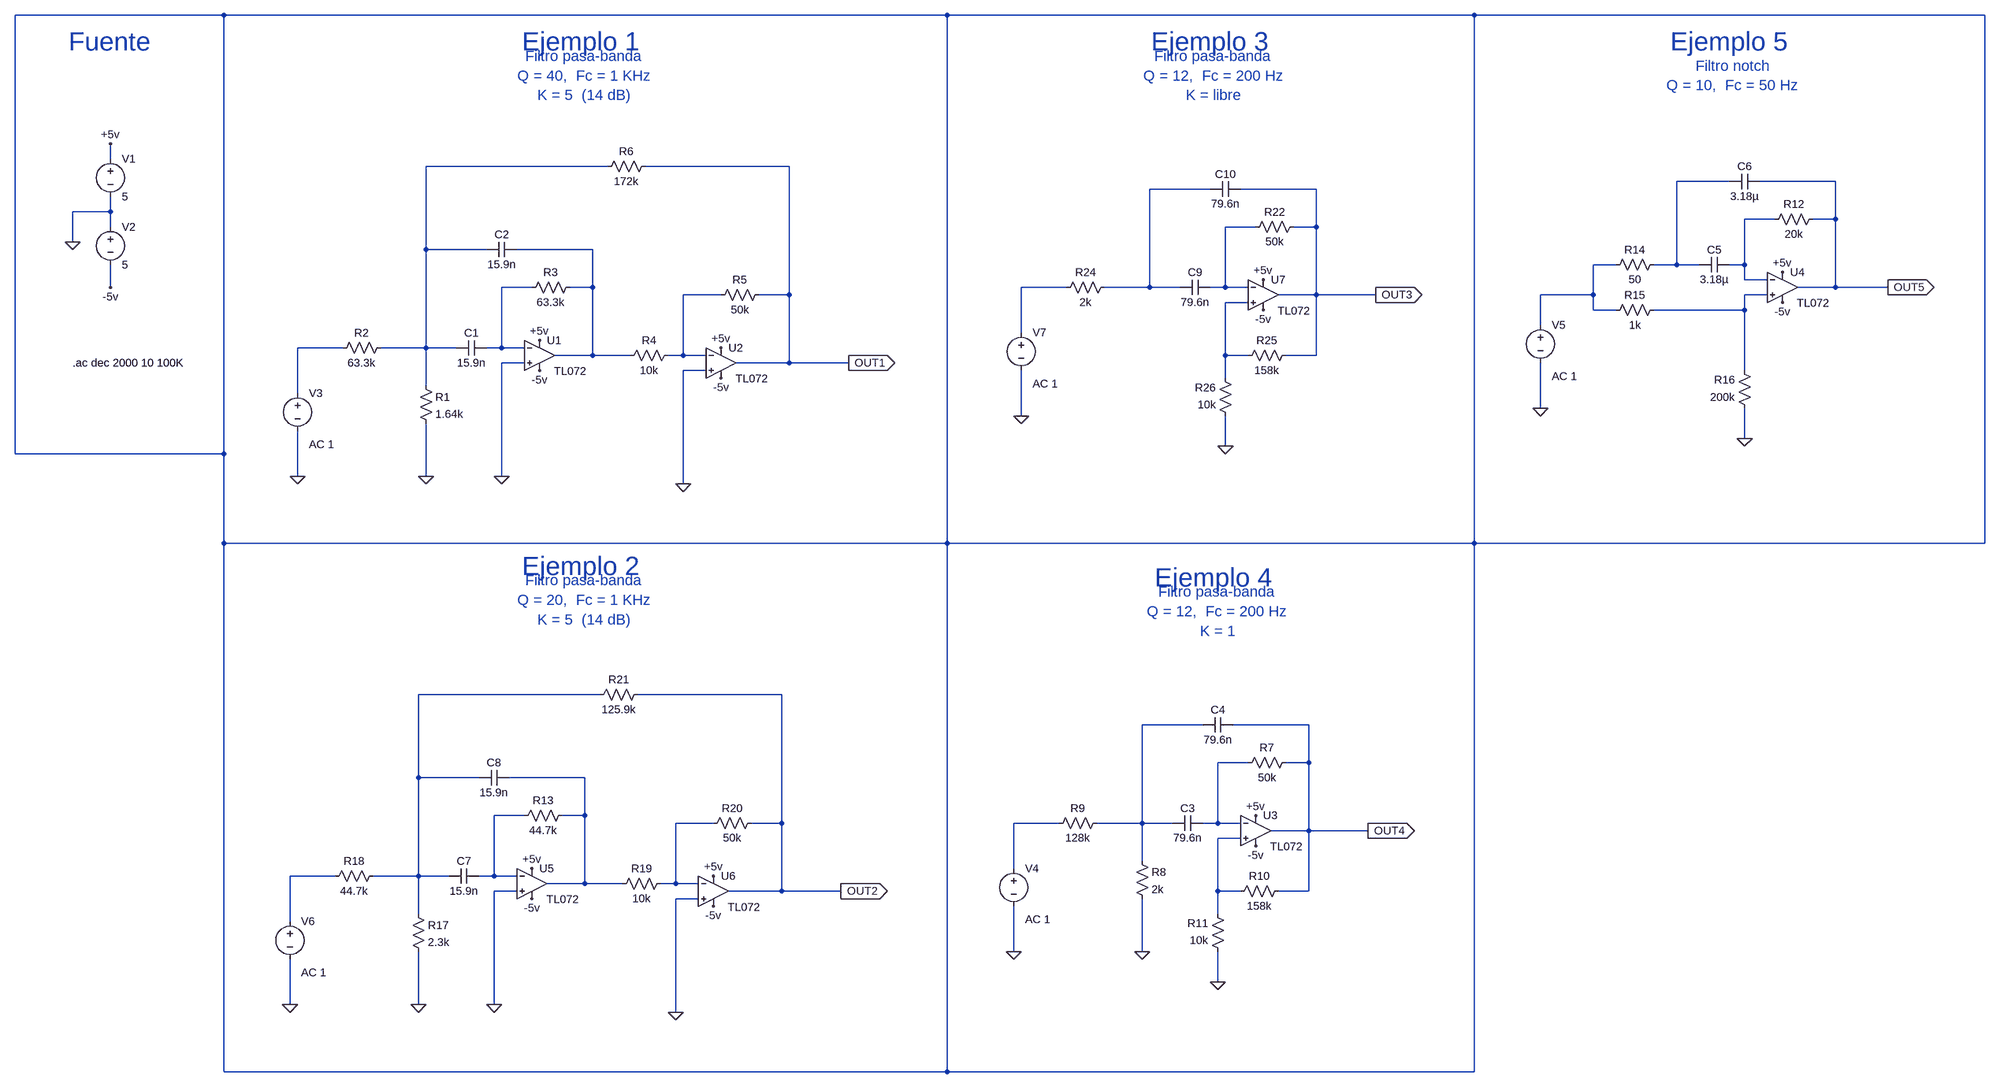
[diagram p0: schematic Filtros3.asc]
Filtros3.asc, the LTspice schematic file:
Version 4
SHEET 1 11276 4980
WIRE -352 -464 -832 -464
WIRE 1280 -464 -352 -464
WIRE 2480 -464 1280 -464
WIRE 3680 -464 2480 -464
WIRE -592 -160 -592 -192
WIRE 528 -144 144 -144
WIRE 912 -144 608 -144
WIRE 3088 -112 2976 -112
WIRE 3312 -112 3152 -112
WIRE 1888 -96 1760 -96
WIRE 2112 -96 1952 -96
WIRE -592 -48 -592 -80
WIRE -592 -48 -672 -48
WIRE 3184 -32 3120 -32
WIRE 3312 -32 3312 -112
WIRE 3312 -32 3264 -32
WIRE -592 -16 -592 -48
WIRE 1984 -16 1920 -16
WIRE 2112 -16 2112 -96
WIRE 2112 -16 2064 -16
WIRE -672 16 -672 -48
WIRE 144 32 144 -144
WIRE 272 32 144 32
WIRE 496 32 336 32
WIRE 2848 64 2800 64
WIRE 2976 64 2976 -112
WIRE 2976 64 2928 64
WIRE 3024 64 2976 64
WIRE 3120 64 3120 -32
WIRE 3120 64 3088 64
WIRE 3120 96 3120 64
WIRE 3168 96 3120 96
WIRE -592 112 -592 64
WIRE 368 112 304 112
WIRE 496 112 496 32
WIRE 496 112 448 112
WIRE 1584 112 1488 112
WIRE 1760 112 1760 -96
WIRE 1760 112 1664 112
WIRE 1824 112 1760 112
WIRE 1920 112 1920 -16
WIRE 1920 112 1888 112
WIRE 1968 112 1920 112
WIRE 3312 112 3312 -32
WIRE 3312 112 3232 112
WIRE 3456 112 3312 112
WIRE 768 128 688 128
WIRE 912 128 912 -144
WIRE 912 128 848 128
WIRE 2112 128 2112 -16
WIRE 2112 128 2032 128
WIRE 2256 128 2112 128
WIRE 2800 128 2800 64
WIRE 2800 128 2688 128
WIRE 3168 128 3120 128
WIRE 1968 144 1920 144
WIRE 2800 160 2800 128
WIRE 2848 160 2800 160
WIRE 3120 160 3120 128
WIRE 3120 160 2928 160
WIRE 2688 192 2688 128
WIRE 1488 208 1488 112
WIRE -32 240 -128 240
WIRE 144 240 144 32
WIRE 144 240 48 240
WIRE 208 240 144 240
WIRE 304 240 304 112
WIRE 304 240 272 240
WIRE 352 240 304 240
WIRE 496 256 496 112
WIRE 496 256 416 256
WIRE 576 256 496 256
WIRE 688 256 688 128
WIRE 688 256 656 256
WIRE 736 256 688 256
WIRE 1920 256 1920 144
WIRE 1968 256 1920 256
WIRE 2112 256 2112 128
WIRE 2112 256 2048 256
WIRE 352 272 304 272
WIRE 912 272 912 128
WIRE 912 272 800 272
WIRE 1056 272 912 272
WIRE 736 288 688 288
WIRE 3120 288 3120 160
WIRE 1920 304 1920 256
WIRE 144 320 144 240
WIRE -128 336 -128 240
WIRE 2688 368 2688 272
WIRE 1488 384 1488 288
WIRE 3120 432 3120 368
WIRE 1920 448 1920 384
WIRE -832 464 -832 -464
WIRE -352 464 -352 -464
WIRE -352 464 -832 464
WIRE -128 512 -128 416
WIRE 144 512 144 400
WIRE 304 512 304 272
WIRE 688 528 688 288
WIRE -352 672 -352 464
WIRE 1280 672 1280 -464
WIRE 1280 672 -352 672
WIRE 2480 672 2480 -464
WIRE 2480 672 1280 672
WIRE 3680 672 3680 -464
WIRE 3680 672 2480 672
WIRE 512 992 128 992
WIRE 896 992 592 992
WIRE 1872 1056 1744 1056
WIRE 2096 1056 1936 1056
WIRE 1968 1136 1904 1136
WIRE 2096 1136 2096 1056
WIRE 2096 1136 2048 1136
WIRE 128 1168 128 992
WIRE 256 1168 128 1168
WIRE 480 1168 320 1168
WIRE 352 1248 288 1248
WIRE 480 1248 480 1168
WIRE 480 1248 432 1248
WIRE 752 1264 672 1264
WIRE 896 1264 896 992
WIRE 896 1264 832 1264
WIRE 1568 1264 1472 1264
WIRE 1744 1264 1744 1056
WIRE 1744 1264 1648 1264
WIRE 1808 1264 1744 1264
WIRE 1904 1264 1904 1136
WIRE 1904 1264 1872 1264
WIRE 1952 1264 1904 1264
WIRE 2096 1280 2096 1136
WIRE 2096 1280 2016 1280
WIRE 2240 1280 2096 1280
WIRE 1952 1296 1904 1296
WIRE 1744 1344 1744 1264
WIRE 1472 1360 1472 1264
WIRE -48 1376 -144 1376
WIRE 128 1376 128 1168
WIRE 128 1376 32 1376
WIRE 192 1376 128 1376
WIRE 288 1376 288 1248
WIRE 288 1376 256 1376
WIRE 336 1376 288 1376
WIRE 480 1392 480 1248
WIRE 480 1392 400 1392
WIRE 560 1392 480 1392
WIRE 672 1392 672 1264
WIRE 672 1392 640 1392
WIRE 720 1392 672 1392
WIRE 336 1408 288 1408
WIRE 896 1408 896 1264
WIRE 896 1408 784 1408
WIRE 1040 1408 896 1408
WIRE 1904 1408 1904 1296
WIRE 1952 1408 1904 1408
WIRE 2096 1408 2096 1280
WIRE 2096 1408 2032 1408
WIRE 720 1424 672 1424
WIRE 128 1456 128 1376
WIRE 1904 1456 1904 1408
WIRE -144 1472 -144 1376
WIRE 1472 1536 1472 1440
WIRE 1744 1536 1744 1424
WIRE 1904 1600 1904 1536
WIRE -144 1648 -144 1552
WIRE 128 1648 128 1536
WIRE 288 1648 288 1408
WIRE 672 1664 672 1424
WIRE -352 1792 -352 672
WIRE 1280 1792 1280 672
WIRE 1280 1792 -352 1792
WIRE 2480 1792 2480 672
WIRE 2480 1792 1280 1792
FLAG -672 16 0
FLAG -592 -192 +5v
FLAG -592 112 -5v
FLAG 384 288 -5v
FLAG 384 224 +5v
FLAG 304 512 0
FLAG 144 512 0
FLAG -128 512 0
FLAG 768 304 -5v
FLAG 768 240 +5v
FLAG 688 528 0
FLAG 1056 272 OUT1
IOPIN 1056 272 Out
FLAG 1984 1312 -5v
FLAG 1984 1248 +5v
FLAG 1744 1536 0
FLAG 1472 1536 0
FLAG 2240 1280 OUT4
IOPIN 2240 1280 Out
FLAG 1904 1600 0
FLAG 3200 144 -5v
FLAG 3200 80 +5v
FLAG 2688 368 0
FLAG 3456 112 OUT5
IOPIN 3456 112 Out
FLAG 3120 432 0
FLAG 368 1424 -5v
FLAG 368 1360 +5v
FLAG 288 1648 0
FLAG 128 1648 0
FLAG -144 1648 0
FLAG 752 1440 -5v
FLAG 752 1376 +5v
FLAG 672 1664 0
FLAG 1040 1408 OUT2
IOPIN 1040 1408 Out
FLAG 2000 160 -5v
FLAG 2000 96 +5v
FLAG 1488 384 0
FLAG 2256 128 OUT3
IOPIN 2256 128 Out
FLAG 1920 448 0
SYMBOL AutoGenerated\\TL072 384 256 R0
WINDOW 3 65 18 Top 2
SYMATTR InstName U1
SYMBOL voltage -592 -176 R0
WINDOW 123 0 0 Left 0
WINDOW 39 0 0 Left 0
SYMATTR InstName V1
SYMATTR Value 5
SYMBOL voltage -592 -32 R0
WINDOW 123 0 0 Left 0
WINDOW 39 0 0 Left 0
SYMATTR InstName V2
SYMATTR Value 5
SYMBOL res 352 128 R270
WINDOW 0 32 56 VTop 2
WINDOW 3 0 56 VBottom 2
SYMATTR InstName R3
SYMATTR Value 63.3k
SYMBOL voltage -128 320 R0
WINDOW 123 24 124 Left 2
WINDOW 39 0 0 Left 0
SYMATTR Value2 AC 1
SYMATTR InstName V3
SYMATTR Value ""
SYMBOL res 128 304 R0
SYMATTR InstName R1
SYMATTR Value 1.64k
SYMBOL res -48 256 R270
WINDOW 0 32 56 VTop 2
WINDOW 3 0 56 VBottom 2
SYMATTR InstName R2
SYMATTR Value 63.3k
SYMBOL AutoGenerated\\TL072 768 272 R0
WINDOW 3 65 18 Top 2
SYMATTR InstName U2
SYMBOL res 560 272 R270
WINDOW 0 32 56 VTop 2
WINDOW 3 0 56 VBottom 2
SYMATTR InstName R4
SYMATTR Value 10k
SYMBOL cap 272 224 R90
WINDOW 0 0 32 VBottom 2
WINDOW 3 32 32 VTop 2
SYMATTR InstName C1
SYMATTR Value 15.9n
SYMBOL cap 336 16 R90
WINDOW 0 0 32 VBottom 2
WINDOW 3 32 32 VTop 2
SYMATTR InstName C2
SYMATTR Value 15.9n
SYMBOL res 864 112 R90
WINDOW 0 0 56 VBottom 2
WINDOW 3 32 56 VTop 2
SYMATTR InstName R5
SYMATTR Value 50k
SYMBOL res 624 -160 R90
WINDOW 0 0 56 VBottom 2
WINDOW 3 32 56 VTop 2
SYMATTR InstName R6
SYMATTR Value 172k
SYMBOL AutoGenerated\\TL072 1984 1280 R0
WINDOW 3 65 18 Top 2
SYMATTR InstName U3
SYMBOL res 1952 1152 R270
WINDOW 0 32 56 VTop 2
WINDOW 3 0 56 VBottom 2
SYMATTR InstName R7
SYMATTR Value 50k
SYMBOL voltage 1472 1344 R0
WINDOW 123 24 124 Left 2
WINDOW 39 0 0 Left 0
SYMATTR Value2 AC 1
SYMATTR InstName V4
SYMATTR Value ""
SYMBOL res 1728 1328 R0
SYMATTR InstName R8
SYMATTR Value 2k
SYMBOL res 1552 1280 R270
WINDOW 0 32 56 VTop 2
WINDOW 3 0 56 VBottom 2
SYMATTR InstName R9
SYMATTR Value 128k
SYMBOL cap 1872 1248 R90
WINDOW 0 0 32 VBottom 2
WINDOW 3 32 32 VTop 2
SYMATTR InstName C3
SYMATTR Value 79.6n
SYMBOL cap 1936 1040 R90
WINDOW 0 0 32 VBottom 2
WINDOW 3 32 32 VTop 2
SYMATTR InstName C4
SYMATTR Value 79.6n
SYMBOL res 2048 1392 R90
WINDOW 0 0 56 VBottom 2
WINDOW 3 32 56 VTop 2
SYMATTR InstName R10
SYMATTR Value 158k
SYMBOL res 1920 1552 R180
WINDOW 0 36 76 Left 2
WINDOW 3 36 40 Left 2
SYMATTR InstName R11
SYMATTR Value 10k
SYMBOL AutoGenerated\\TL072 3200 112 R0
WINDOW 3 65 18 Top 2
SYMATTR InstName U4
SYMBOL res 3168 -16 R270
WINDOW 0 32 56 VTop 2
WINDOW 3 0 56 VBottom 2
SYMATTR InstName R12
SYMATTR Value 20k
SYMBOL voltage 2688 176 R0
WINDOW 123 24 124 Left 2
WINDOW 39 0 0 Left 0
SYMATTR Value2 AC 1
SYMATTR InstName V5
SYMATTR Value ""
SYMBOL cap 3088 48 R90
WINDOW 0 0 32 VBottom 2
WINDOW 3 32 32 VTop 2
SYMATTR InstName C5
SYMATTR Value 3.18µ
SYMBOL res 3136 384 R180
WINDOW 0 36 76 Left 2
WINDOW 3 36 40 Left 2
SYMATTR InstName R16
SYMATTR Value 200k
SYMBOL res 2944 48 R90
WINDOW 0 0 56 VBottom 2
WINDOW 3 32 56 VTop 2
SYMATTR InstName R14
SYMATTR Value 50
SYMBOL res 2944 144 R90
WINDOW 0 0 56 VBottom 2
WINDOW 3 32 56 VTop 2
SYMATTR InstName R15
SYMATTR Value 1k
SYMBOL cap 3152 -128 R90
WINDOW 0 0 32 VBottom 2
WINDOW 3 32 32 VTop 2
SYMATTR InstName C6
SYMATTR Value 3.18µ
SYMBOL AutoGenerated\\TL072 368 1392 R0
WINDOW 3 65 18 Top 2
SYMATTR InstName U5
SYMBOL res 336 1264 R270
WINDOW 0 32 56 VTop 2
WINDOW 3 0 56 VBottom 2
SYMATTR InstName R13
SYMATTR Value 44.7k
SYMBOL voltage -144 1456 R0
WINDOW 123 24 124 Left 2
WINDOW 39 0 0 Left 0
SYMATTR Value2 AC 1
SYMATTR InstName V6
SYMATTR Value ""
SYMBOL res 112 1440 R0
SYMATTR InstName R17
SYMATTR Value 2.3k
SYMBOL res -64 1392 R270
WINDOW 0 32 56 VTop 2
WINDOW 3 0 56 VBottom 2
SYMATTR InstName R18
SYMATTR Value 44.7k
SYMBOL AutoGenerated\\TL072 752 1408 R0
WINDOW 3 65 18 Top 2
SYMATTR InstName U6
SYMBOL res 544 1408 R270
WINDOW 0 32 56 VTop 2
WINDOW 3 0 56 VBottom 2
SYMATTR InstName R19
SYMATTR Value 10k
SYMBOL cap 256 1360 R90
WINDOW 0 0 32 VBottom 2
WINDOW 3 32 32 VTop 2
SYMATTR InstName C7
SYMATTR Value 15.9n
SYMBOL cap 320 1152 R90
WINDOW 0 0 32 VBottom 2
WINDOW 3 32 32 VTop 2
SYMATTR InstName C8
SYMATTR Value 15.9n
SYMBOL res 848 1248 R90
WINDOW 0 0 56 VBottom 2
WINDOW 3 32 56 VTop 2
SYMATTR InstName R20
SYMATTR Value 50k
SYMBOL res 608 976 R90
WINDOW 0 0 56 VBottom 2
WINDOW 3 32 56 VTop 2
SYMATTR InstName R21
SYMATTR Value 125.9k
SYMBOL AutoGenerated\\TL072 2000 128 R0
WINDOW 3 65 18 Top 2
SYMATTR InstName U7
SYMBOL res 1968 0 R270
WINDOW 0 32 56 VTop 2
WINDOW 3 0 56 VBottom 2
SYMATTR InstName R22
SYMATTR Value 50k
SYMBOL voltage 1488 192 R0
WINDOW 123 24 124 Left 2
WINDOW 39 0 0 Left 0
SYMATTR Value2 AC 1
SYMATTR InstName V7
SYMATTR Value ""
SYMBOL res 1568 128 R270
WINDOW 0 32 56 VTop 2
WINDOW 3 0 56 VBottom 2
SYMATTR InstName R24
SYMATTR Value 2k
SYMBOL cap 1888 96 R90
WINDOW 0 0 32 VBottom 2
WINDOW 3 32 32 VTop 2
SYMATTR InstName C9
SYMATTR Value 79.6n
SYMBOL cap 1952 -112 R90
WINDOW 0 0 32 VBottom 2
WINDOW 3 32 32 VTop 2
SYMATTR InstName C10
SYMATTR Value 79.6n
SYMBOL res 2064 240 R90
WINDOW 0 0 56 VBottom 2
WINDOW 3 32 56 VTop 2
SYMATTR InstName R25
SYMATTR Value 158k
SYMBOL res 1936 400 R180
WINDOW 0 36 76 Left 2
WINDOW 3 36 40 Left 2
SYMATTR InstName R26
SYMATTR Value 10k
TEXT 480 -336 Center 3 ;Filtro pasa-banda\nQ = 40,  Fc = 1 KHz\nK = 5  (14 dB)
TEXT 472 -408 Center 5 ;Ejemplo 1
TEXT -592 -408 Center 5 ;Fuente
TEXT -672 272 Left 2 !.ac dec 2000 10 100K
TEXT 480 792 Center 3 ;Filtro pasa-banda\nQ = 20,  Fc = 1 KHz\nK = 5  (14 dB)
TEXT 472 720 Center 5 ;Ejemplo 2
TEXT 1896 -336 Center 3 ;Filtro pasa-banda\nQ = 12,  Fc = 200 Hz\nK = libre
TEXT 1888 -408 Center 5 ;Ejemplo 3
TEXT 1904 816 Center 3 ;Filtro pasa-banda\nQ = 12,  Fc = 200 Hz\nK = 1
TEXT 1896 744 Center 5 ;Ejemplo 4
TEXT 3096 -336 Center 3 ;Filtro notch\nQ = 10,  Fc = 50 Hz
TEXT 3088 -408 Center 5 ;Ejemplo 5

The netlist it stands for:
* Filtros3.asc
* U1: TL072 (symbol AutoGenerated\TL072 not available, pins judged from their places): In+=0 In-=N009 V+=+5v V-=-5v OUT=N007
V1 +5v 0 5
V2 0 -5v 5
R3 N009 N007 63.3k
V3 N014 0 AC 1
R1 N002 0 1.64k
R2 N014 N002 63.3k
* U2: TL072 (symbol AutoGenerated\TL072 not available, pins judged from their places): In+=0 In-=N011 V+=+5v V-=-5v OUT=OUT1
R4 N007 N011 10k
C1 N009 N002 15.9n
C2 N007 N002 15.9n
R5 OUT1 N011 50k
R6 OUT1 N002 172k
* U3: TL072 (symbol AutoGenerated\TL072 not available, pins judged from their places): In+=N022 In-=N017 V+=+5v V-=-5v OUT=OUT4
R7 N017 OUT4 50k
V4 N021 0 AC 1
R8 N016 0 2k
R9 N021 N016 128k
C3 N017 N016 79.6n
C4 OUT4 N016 79.6n
R10 OUT4 N022 158k
R11 0 N022 10k
* U4: TL072 (symbol AutoGenerated\TL072 not available, pins judged from their places): In+=N012 In-=N005 V+=+5v V-=-5v OUT=OUT5
R12 N005 OUT5 20k
V5 N008 0 AC 1
C5 N005 N003 3.18µ
R16 0 N012 200k
R14 N003 N008 50
R15 N012 N008 1k
C6 OUT5 N003 3.18µ
* U5: TL072 (symbol AutoGenerated\TL072 not available, pins judged from their places): In+=0 In-=N019 V+=+5v V-=-5v OUT=N018
R13 N019 N018 44.7k
V6 N023 0 AC 1
R17 N015 0 2.3k
R18 N023 N015 44.7k
* U6: TL072 (symbol AutoGenerated\TL072 not available, pins judged from their places): In+=0 In-=N020 V+=+5v V-=-5v OUT=OUT2
R19 N018 N020 10k
C7 N019 N015 15.9n
C8 N018 N015 15.9n
R20 OUT2 N020 50k
R21 OUT2 N015 125.9k
* U7: TL072 (symbol AutoGenerated\TL072 not available, pins judged from their places): In+=N013 In-=N006 V+=+5v V-=-5v OUT=OUT3
R22 N006 OUT3 50k
V7 N010 0 AC 1
R24 N010 N004 2k
C9 N006 N004 79.6n
C10 OUT3 N004 79.6n
R25 OUT3 N013 158k
R26 0 N013 10k
* Filtro pasa-banda
* Q = 40,  Fc = 1 KHz
* K = 5  (14 dB)
* Ejemplo 1
* Fuente
.ac dec 2000 10 100K
* Filtro pasa-banda
* Q = 20,  Fc = 1 KHz
* K = 5  (14 dB)
* Ejemplo 2
* Filtro pasa-banda
* Q = 12,  Fc = 200 Hz
* K = libre
* Ejemplo 3
* Filtro pasa-banda
* Q = 12,  Fc = 200 Hz
* K = 1
* Ejemplo 4
* Filtro notch
* Q = 10,  Fc = 50 Hz
* Ejemplo 5
.backanno
.end